# Altium schematic sheet 示波器原理图2.SchDoc
size A4
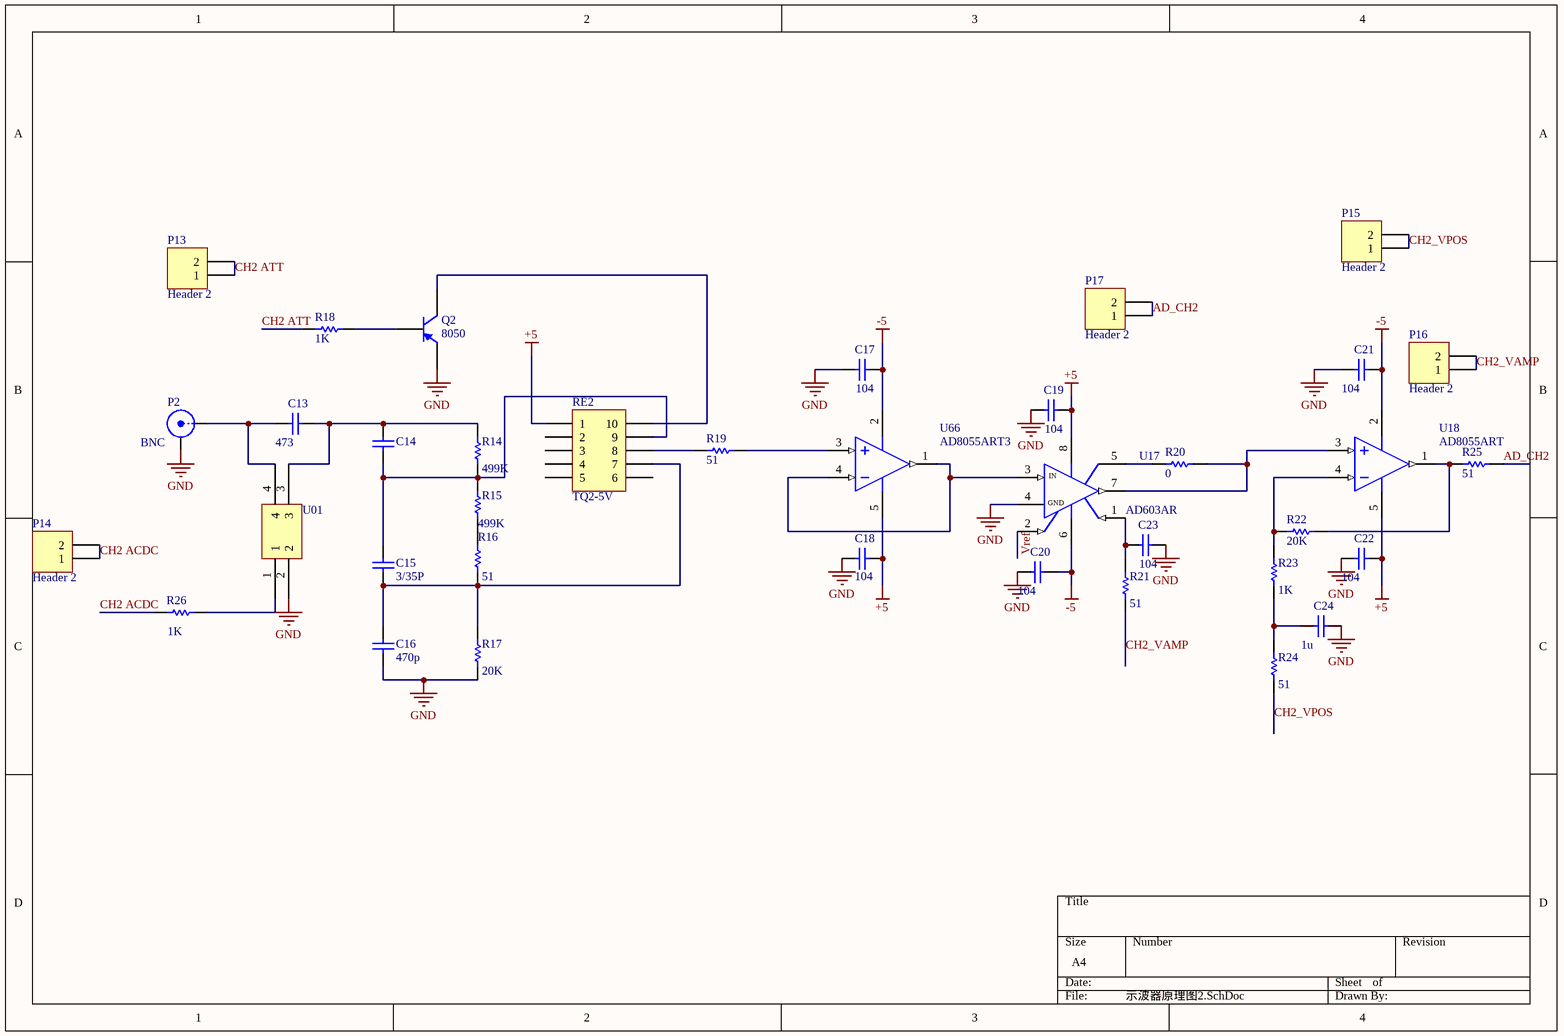
[diagram p0: 示波器原理图2.SchDoc]

## Parts
C13  value 473  [PCBComponent_1]
C14  (no value)  [PCBComponent_1]
C15  value 3/35P  [PCBComponent_1]
C16  value 470p  [PCBComponent_1]
C17  104  [PCBComponent_1]
C18  value 104  [PCBComponent_1]
C19  value 104  [PCBComponent_1]
C20  value 104  [PCBComponent_1]
C21  value 104  [PCBComponent_1]
C22  value 104  [PCBComponent_1]
C23  value 104  [PCBComponent_1]
C24  value 1u  [PCBComponent_1]
P2  BNC  [BNC_RA CON]
P13  Header 2  [HDR1X2]
P14  Header 2  [HDR1X2]
P15  Header 2  [HDR1X2]
P16  Header 2  [HDR1X2]
P17  Header 2  [HDR1X2]
Q2  8050  [PCBComponent_1]
R14  value 499K  [PCBComponent_1]
R15  value 499K  [PCBComponent_1]
R16  value 51  [PCBComponent_1]
R17  value 20K  [2012[0805]]
R18  value 1K  [PCBComponent_1]
R19  value 51  [PCBComponent_1]
R20  value 0  [2012[0805]]
R21  value 51  [2012[0805]]
R22  value 20K  [2012[0805]]
R23  value 1K  [2012[0805]]
R24  value 51  [2012[0805]]
R25  value 51  [2012[0805]]
R26  value 1K  [PCBComponent_1]
RE2  TQ2-5V  [PCBComponent_1]
U01  (no value)  [SOP254P610X218-4N]
U17  AD603AR  [SOIC127P600X175-8N]
U18  AD8055ART  [SOT95P245X110-5N]
U66  AD8055ART3  [SOT95P245X110-5N]

## Nets
+5: C18.1 C19.2 C22.2 RE2.1 U17.8(V+) U18.5(V+) U66.5(V+)
-5: C17.1 C20.2 C21.2 U17.6(V-) U18.2(V-) U66.2(V-)
GND: C16.1 C17.2 C18.2 C19.1 C20.1 C21.1 C22.1 C23.2 C24.2 P2.2(Y) Q2.1(E) R17.1 U01.2 U17.4(COMM)
AD_CH2: P17.1 P17.2 R25.1
CH2 ACDC: P14.1 P14.2 R26.1
CH2 ATT: P13.1 P13.2 R18.2
CH2_VAMP: P16.1 P16.2 R21.1
CH2_VPOS: P15.1 P15.2 R24.1
Vref: U17.2(G-)
NetC13_1: C13.1 P2.1(X) U01.4
NetC13_2: C13.2 C14.2 R14.2 U01.3
NetC14_1: C14.1 C15.2 R14.1 R15.2 RE2.9
NetC15_1: C15.1 C16.2 R16.1 R17.2 RE2.7
NetC23_1: C23.1 R21.2 U17.1(G+)
NetC24_1: C24.1 R23.1 R24.2
NetQ2_2: Q2.2(B) R18.1
NetQ2_3: Q2.3(C) RE2.10
NetR15_1: R15.1 R16.2
NetR19_1: R19.1 U66.3(IN+)
NetR19_2: R19.2 RE2.8
NetR20_1: R20.1 U17.7(VOUT) U18.3(IN+)
NetR20_2: R20.2 U17.5(FDBK)
NetR22_1: R22.1 R25.2 U18.1(OUT)
NetR22_2: R22.2 R23.2 U18.4(IN-)
NetR26_2: R26.2 U01.1
NetU17_3: U17.3(VINP) U66.1(OUT) U66.4(IN-)

Not connected (* = marked no-connect by the designer): RE2 2 3 4 5 6

## Notes on the sheet
- (in symbol AD603AR) IN; GND

## Library data of the parts
C13-C24 = Cap: Capacitor; Published: 8-Jun-2000; LatestRevisionDate: 17-Jul-2002; LatestRevisionNote: Re-released for DXP Platform.; PackageReference: RAD-0.3; Publisher: Altium Limited
P2 = BNC: BNC Elbow Connector; LatestRevisionDate: 17-Jul-2002; LatestRevisionNote: Re-released for DXP Platform.; Publisher: Altium Limited
P13-P17 = Header 2: Header, 2-Pin; LatestRevisionDate: 17-Jul-2002; LatestRevisionNote: Re-released for DXP Platform.; Publisher: Altium Limited
Q2 = 2N3906: PNP General Purpose Amplifier; Published: 8-Jun-2000; LatestRevisionDate: 15-Jan-2003; LatestRevisionNote: PCB Footprint 'BCY-W3/D4.7' replaced; DatasheetDocument: 1997; PackageDocument: Sep-1998; PackageReference: TO-92A; Publisher: Altium Limited; Code_JEDEC: TO-92A; ComponentLink1Description: Manufacturer Link; ComponentLink1URL: http://www.fairchildsemi.com/; ComponentLink2Description: Datasheet; ComponentLink2URL: http://www.fairchildsemi.com/ds/2N%2F2N3906.pdf
R14-R16 R18 R19 R26 = Res1: Resistor; Published: 8-Jun-2000; LatestRevisionDate: 17-Jul-2002; LatestRevisionNote: Re-released for DXP Platform.; PackageReference: AXIAL-0.3; Publisher: Altium Limited
R17 R20-R25 = Res Semi: Semiconductor Resistor; Published: 8-Jun-2000; LatestRevisionDate: 17-Jul-2002; LatestRevisionNote: Re-released for DXP Platform.; PackageReference: AXIAL-0.5; Publisher: Altium Limited
RE2 U01 = Component_1
U17 = AD603AR: Low-Noise, 90MHz Variable Gain Amplifier; Text Field7: Published 8-Jun-2000, Modified 10-July-2000: SIM Model Added.
U18 U66 = AD8055ART: Low Cost, 300MHz Voltage Feedback Amplifier; Text Field7: Published 8-Jun-2000